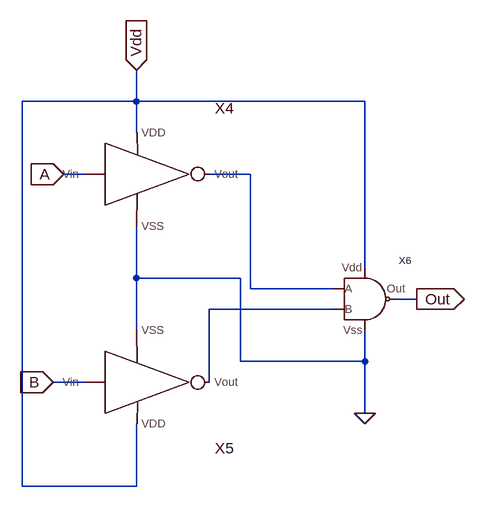
[diagram p0: schematic OR_T.asc]
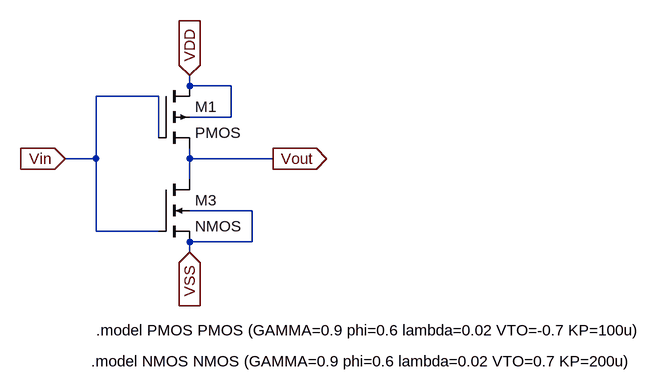
[diagram p1: sub-circuit inverter.asc]
OR_T.asc, the LTspice schematic file:
Version 4
SHEET 1 880 680
WIRE -416 -224 -416 -272
WIRE -416 -224 -592 -224
WIRE -64 -224 -416 -224
WIRE -416 -176 -416 -224
WIRE -496 -112 -528 -112
WIRE -240 -112 -304 -112
WIRE -64 32 -64 -224
WIRE -416 48 -416 -32
WIRE -256 48 -416 48
WIRE -240 64 -240 -112
WIRE -112 64 -240 64
WIRE 16 80 -16 80
WIRE -112 96 -304 96
WIRE -416 128 -416 48
WIRE -256 176 -256 48
WIRE -64 176 -64 128
WIRE -64 176 -256 176
WIRE -496 208 -544 208
WIRE -304 208 -304 96
WIRE -64 256 -64 176
WIRE -592 368 -592 -224
WIRE -416 368 -416 272
WIRE -416 368 -592 368
FLAG -528 -112 A
IOPIN -528 -112 In
FLAG -544 208 B
IOPIN -544 208 In
FLAG 16 80 Out
IOPIN 16 80 Out
FLAG -416 -272 Vdd
IOPIN -416 -272 In
FLAG -64 256 0
SYMBOL INVERTER -464 -112 R0
SYMATTR InstName X4
SYMBOL INVERTER -464 208 M180
SYMATTR InstName X5
SYMBOL NAND -96 80 R0
SYMATTR InstName X6

inverter.asc, the sub-circuit schematic file:
Version 4
SHEET 1 984 680
WIRE 112 32 112 16
WIRE 176 32 112 32
WIRE 64 48 -32 48
WIRE 176 80 176 32
WIRE 176 80 112 80
WIRE 64 112 64 48
WIRE -32 144 -32 48
WIRE -32 144 -80 144
WIRE 112 144 112 128
WIRE 240 144 112 144
WIRE 112 176 112 144
WIRE 208 224 112 224
WIRE -32 256 -32 144
WIRE 64 256 -32 256
WIRE 208 272 208 224
WIRE 208 272 112 272
WIRE 112 288 112 272
FLAG -80 144 Vin
IOPIN -80 144 In
FLAG 240 144 Vout
IOPIN 240 144 Out
FLAG 112 16 VDD
IOPIN 112 16 In
FLAG 112 288 VSS
IOPIN 112 288 In
SYMBOL pmos4 64 32 R0
SYMATTR InstName M1
SYMATTR Value2 l=1u w=50u
SYMBOL nmos4 64 176 R0
SYMATTR InstName M3
SYMATTR Value2 l=1u w=100u
TEXT -32 408 Left 2 !.model PMOS PMOS (GAMMA=0.9 phi=0.6 lambda=0.02 VTO=-0.7 KP=100u)
TEXT -40 456 Left 2 !.model NMOS NMOS (GAMMA=0.9 phi=0.6 lambda=0.02 VTO=0.7 KP=200u)

The netlist it stands for:
* OR_T.asc
XX4 Vdd A 0 N001 inverter
XX5 Vdd B 0 N002 inverter
XX6 N001 N002 Out 0 Vdd NAND  ; pins A B Out Vss Vdd

* block symbol definitions
.subckt inverter VDD Vin VSS Vout
M1 VDD Vin Vout VDD PMOS l=1u w=50u
M3 Vout Vin VSS VSS NMOS l=1u w=100u
.model PMOS PMOS (GAMMA=0.9 phi=0.6 lambda=0.02 VTO=-0.7 KP=100u)
.model NMOS NMOS (GAMMA=0.9 phi=0.6 lambda=0.02 VTO=0.7 KP=200u)
.ends inverter

.model NMOS NMOS
.model PMOS PMOS
.lib standard.mos
.backanno
.end